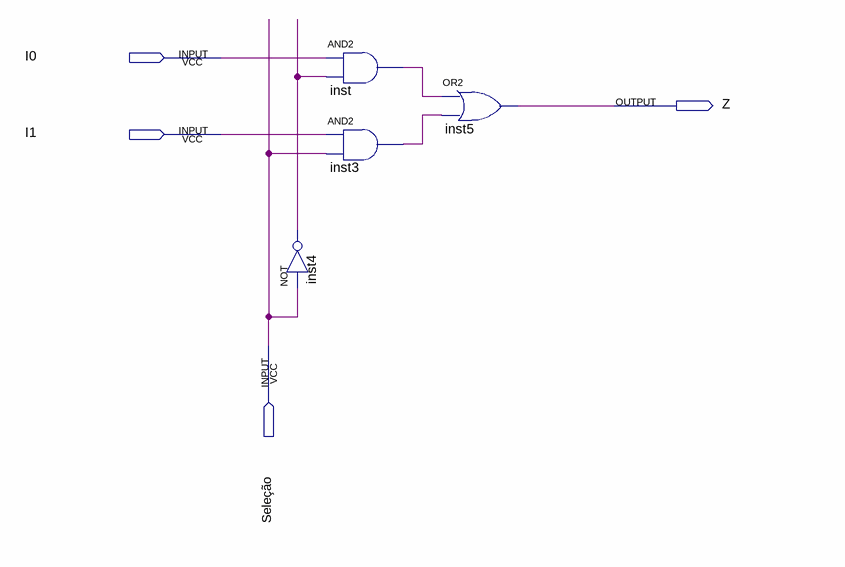
[diagram p0: schematic sheet]
// Quartus schematic Mux2-1.bdf as structural Verilog: 4 symbols, 4 pins
module \Mux2-1  (
  input  I0,
  input  I1,
  input  \Seleção ,
  output Z
);

  wire inst3_out, inst4_out, inst_out;

  not inst4 (inst4_out, \Seleção );
  and inst (inst_out, I0, inst4_out);
  and inst3 (inst3_out, I1, \Seleção );
  or inst5 (Z, inst_out, inst3_out);
endmodule
